# EAGLE design SensorController_revB (EAGLE 6.1)
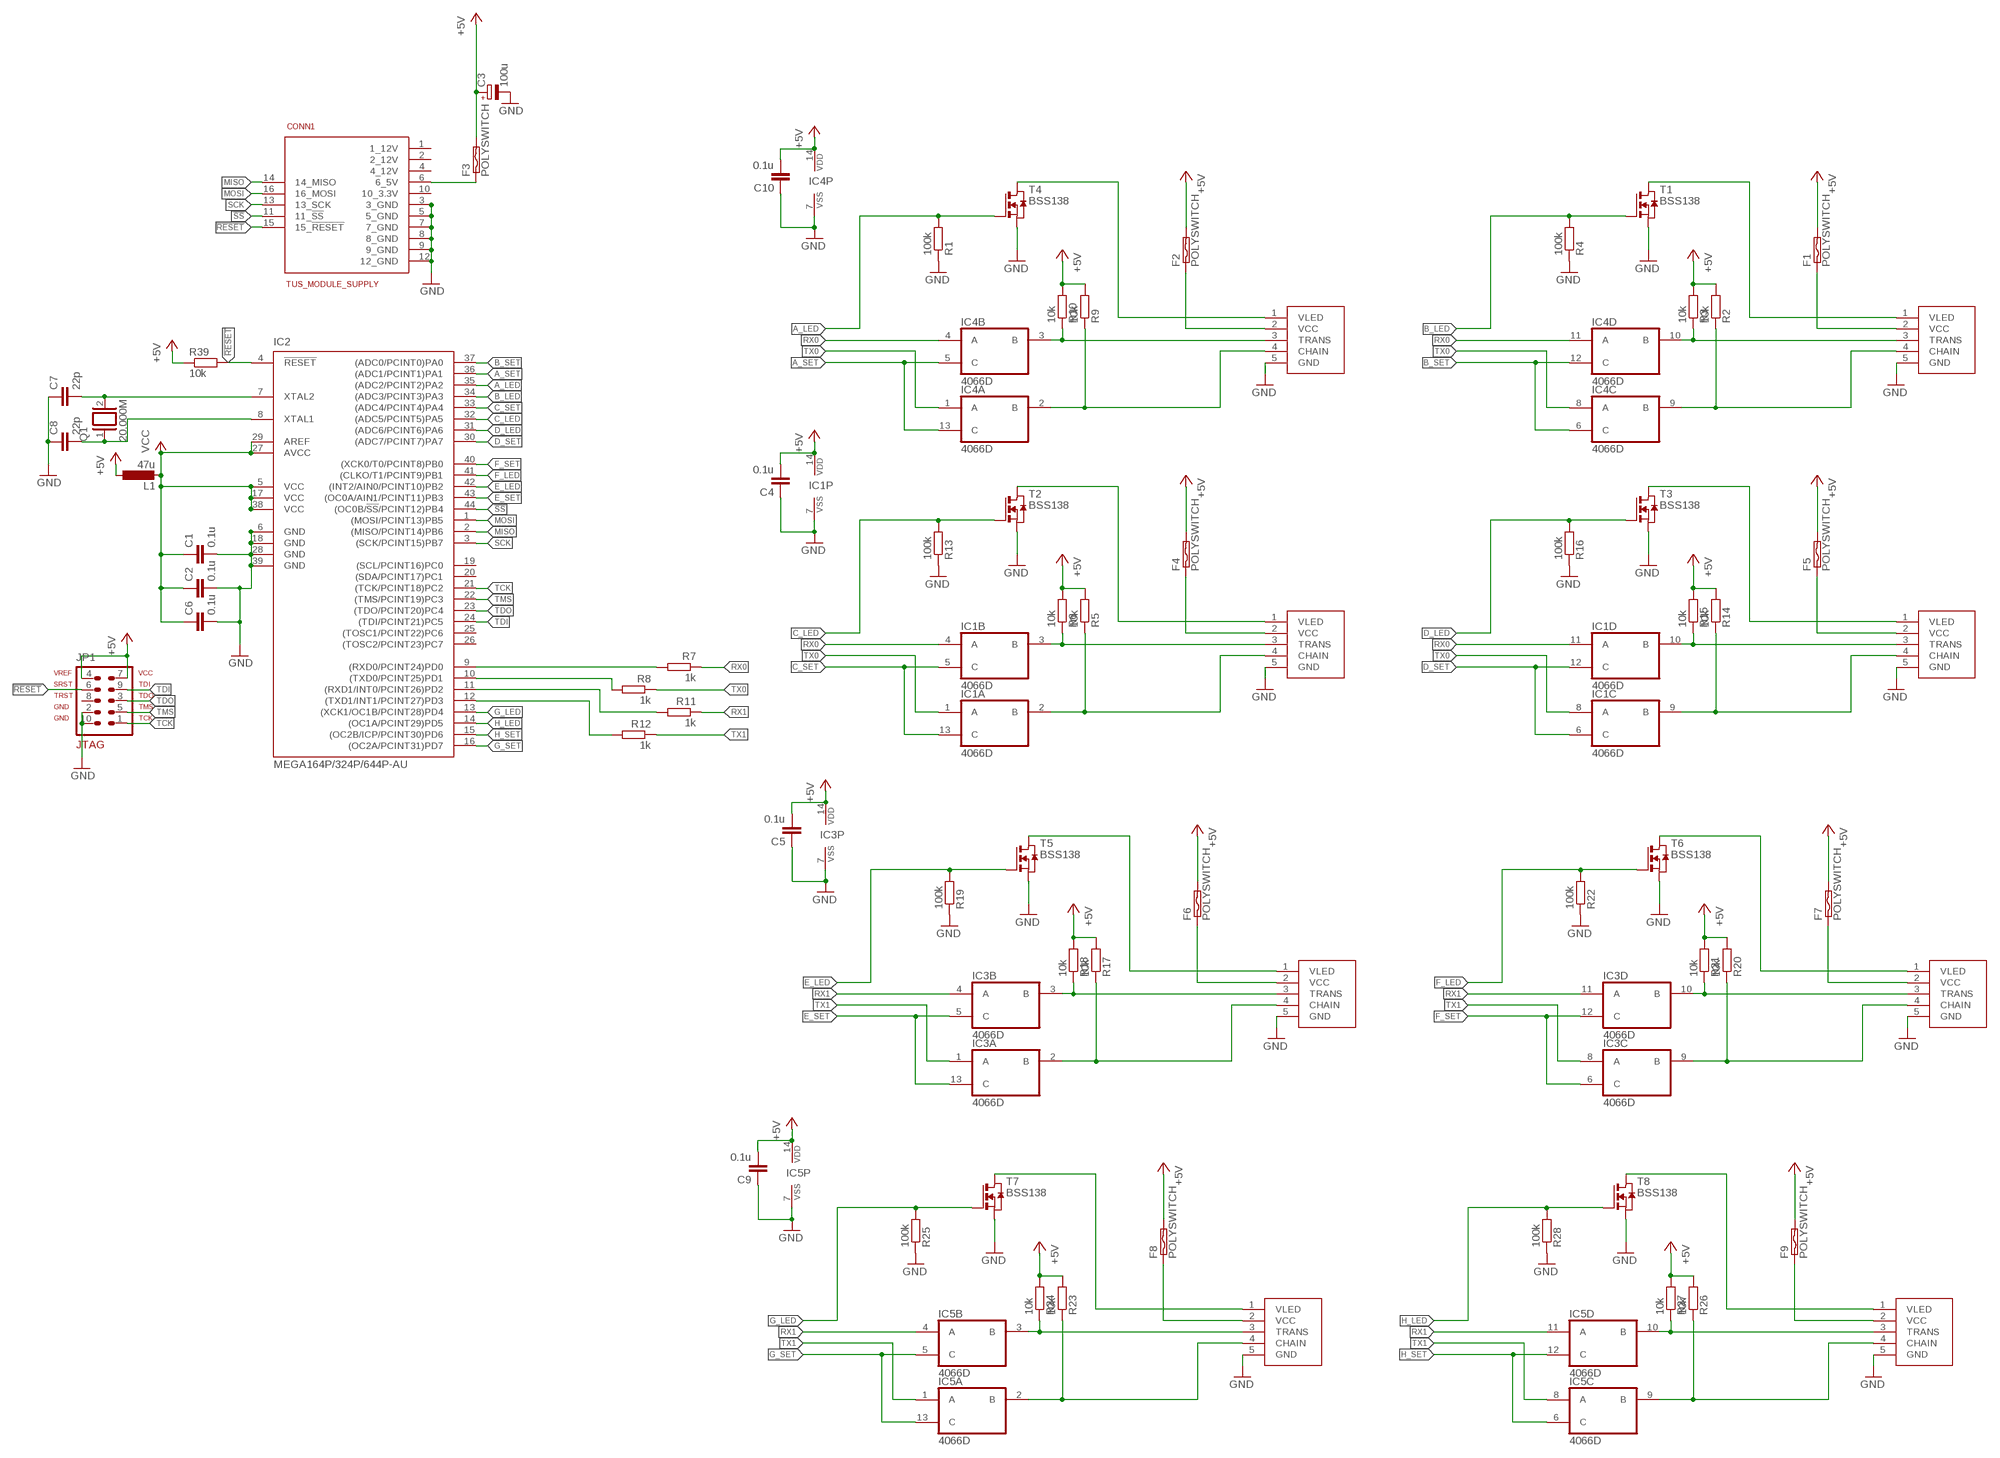
[diagram p0: schematic, sheet 1]

## Parts
A_OUT  SERIAL_SENSORXH  [XH-5]
B_OUT  SERIAL_SENSORXH  [XH-5]
C1  0.1u  C-EUC1608  [C1608]
C2  0.1u  C-EUC1608  [C1608]
C3  100u  CPOL-EUE2.5-5  [E2,5-5]
C4  0.1u  C-EUC1608  [C1608]
C5  0.1u  C-EUC1608  [C1608]
C6  0.1u  C-EUC1608  [C1608]
C7  22p  C-EUC1608  [C1608]
C8  22p  C-EUC1608  [C1608]
C9  0.1u  C-EUC1608  [C1608]
C10  0.1u  C-EUC1608  [C1608]
C_OUT  SERIAL_SENSORXH  [XH-5]
CONN1  TUS_MODULE_SUPPLY  [2X08]
D_OUT  SERIAL_SENSORXH  [XH-5]
E_OUT  SERIAL_SENSORXH  [XH-5]
F1  POLYSWITCH  [0207/2V]
F2  POLYSWITCH  [0207/2V]
F3  POLYSWITCH  [0207/2V]
F4  POLYSWITCH  [0207/2V]
F5  POLYSWITCH  [0207/2V]
F6  POLYSWITCH  [0207/2V]
F7  POLYSWITCH  [0207/2V]
F8  POLYSWITCH  [0207/2V]
F9  POLYSWITCH  [0207/2V]
F_OUT  SERIAL_SENSORXH  [XH-5]
G_OUT  SERIAL_SENSORXH  [XH-5]
H_OUT  SERIAL_SENSORXH  [XH-5]
IC1  4066D  [SO14]
IC2  MEGA164P/324P/644P-AU  [TQFP44]
IC3  4066D  [SO14]
IC4  4066D  [SO14]
IC5  4066D  [SO14]
JP1  AVR-JTAG-10  [AVR-JTAG-10]
L1  47u  L-EUL1812  [L1812]
Q1  20.000M  XTAL/S  [QS]
R1  100k  R-EU_R0603  [R0603]
R2  10k  R-EU_R0603  [R0603]
R3  10k  R-EU_R0603  [R0603]
R4  100k  R-EU_R0603  [R0603]
R5  10k  R-EU_R0603  [R0603]
R6  10k  R-EU_R0603  [R0603]
R7  1k  R-EU_R0603  [R0603]
R8  1k  R-EU_R0603  [R0603]
R9  10k  R-EU_R0603  [R0603]
R10  10k  R-EU_R0603  [R0603]
R11  1k  R-EU_R0603  [R0603]
R12  1k  R-EU_R0603  [R0603]
R13  100k  R-EU_R0603  [R0603]
R14  10k  R-EU_R0603  [R0603]
R15  10k  R-EU_R0603  [R0603]
R16  100k  R-EU_R0603  [R0603]
R17  10k  R-EU_R0603  [R0603]
R18  10k  R-EU_R0603  [R0603]
R19  100k  R-EU_R0603  [R0603]
R20  10k  R-EU_R0603  [R0603]
R21  10k  R-EU_R0603  [R0603]
R22  100k  R-EU_R0603  [R0603]
R23  10k  R-EU_R0603  [R0603]
R24  10k  R-EU_R0603  [R0603]
R25  100k  R-EU_R0603  [R0603]
R26  10k  R-EU_R0603  [R0603]
R27  10k  R-EU_R0603  [R0603]
R28  100k  R-EU_R0603  [R0603]
R39  10k  R-EU_R0603  [R0603]
T1  BSS138  NMOSSOT23  [SOT-23]
T2  BSS138  NMOSSOT23  [SOT-23]
T3  BSS138  NMOSSOT23  [SOT-23]
T4  BSS138  NMOSSOT23  [SOT-23]
T5  BSS138  NMOSSOT23  [SOT-23]
T6  BSS138  NMOSSOT23  [SOT-23]
T7  BSS138  NMOSSOT23  [SOT-23]
T8  BSS138  NMOSSOT23  [SOT-23]

## Nets
!RESET: CONN1.15(15_!RESET) IC2.4(!RESET) JP1.6 R39.2
!SS: CONN1.11(11_!SS) IC2.44((OC0B/!SS!/PCINT12)PB4)
+5V [+5v]: C3.+ C4.2 C5.2 C9.2 C10.2 F1.2 F2.2 F3.2 F4.2 F5.2 F6.2 F7.2 F8.2 F9.2 IC1.14(P:VDD) IC3.14(P:VDD) IC4.14(P:VDD) IC5.14(P:VDD) JP1.4 JP1.7 L1.1 R2.2 R3.2 R5.2 R6.2 R9.2 R10.2 R14.2 R15.2 R17.2 R18.2 R20.2 R21.2 R23.2 R24.2 R26.2 R27.2 R39.1
A_LED: IC2.35((ADC2/PCINT2)PA2) R1.2 T4.3(G)
A_SET: IC2.36((ADC1/PCINT1)PA1) IC4.5(B:C) IC4.13(A:C)
B_LED: IC2.34((ADC3/PCINT3)PA3) R4.2 T1.3(G)
B_SET: IC2.37((ADC0/PCINT0)PA0) IC4.6(C:C) IC4.12(D:C)
C_LED: IC2.32((ADC5/PCINT5)PA5) R13.2 T2.3(G)
C_SET: IC1.5(B:C) IC1.13(A:C) IC2.33((ADC4/PCINT4)PA4)
D_LED: IC2.31((ADC6/PCINT6)PA6) R16.2 T3.3(G)
D_SET: IC1.6(C:C) IC1.12(D:C) IC2.30((ADC7/PCINT7)PA7)
E_LED: IC2.42((INT2/AIN0/PCINT10)PB2) R19.2 T5.3(G)
E_SET: IC2.43((OC0A/AIN1/PCINT11)PB3) IC3.5(B:C) IC3.13(A:C)
F_LED: IC2.41((CLKO/T1/PCINT9)PB1) R22.2 T6.3(G)
F_SET: IC2.40((XCK0/T0/PCINT8)PB0) IC3.6(C:C) IC3.12(D:C)
G_LED: IC2.13((XCK1/OC1B/PCINT28)PD4) R25.2 T7.3(G)
G_SET: IC2.16((OC2A/PCINT31)PD7) IC5.5(B:C) IC5.13(A:C)
GND: A_OUT.5(GND) B_OUT.5(GND) C1.2 C2.2 C3.- C4.1 C5.1 C6.2 C7.1 C8.1 C9.1 C10.1 C_OUT.5(GND) CONN1.3(3_GND) CONN1.5(5_GND) CONN1.7(7_GND) CONN1.8(8_GND) CONN1.9(9_GND) CONN1.12(12_GND) D_OUT.5(GND) E_OUT.5(GND) F_OUT.5(GND) G_OUT.5(GND) H_OUT.5(GND) IC1.7(P:VSS) IC2.6(GND) IC2.18(GND) IC2.28(GND) IC2.39(GND) IC3.7(P:VSS) IC4.7(P:VSS) IC5.7(P:VSS) JP1.2 JP1.10 R1.1 R4.1 R13.1 R16.1 R19.1 R22.1 R25.1 R28.1 T1.2(S) T2.2(S) T3.2(S) T4.2(S) T5.2(S) T6.2(S) T7.2(S) T8.2(S)
H_LED: IC2.14((OC1A/PCINT29)PD5) R28.2 T8.3(G)
H_SET: IC2.15((OC2B/ICP/PCINT30)PD6) IC5.6(C:C) IC5.12(D:C)
MISO: CONN1.14(14_MISO) IC2.2((MISO/PCINT14)PB6)
MOSI: CONN1.16(16_MOSI) IC2.1((MOSI/PCINT13)PB5)
N$1: A_OUT.1(VLED) T4.1(D)
N$2: C8.2 IC2.8(XTAL1) Q1.1
N$3: B_OUT.4(CHAIN) IC4.9(C:B) R2.1
N$4: C7.2 IC2.7(XTAL2) Q1.2
N$5: B_OUT.3(TRANS) IC4.10(D:B) R3.1
N$6 [+5v]: B_OUT.2(VCC) F1.1
N$7: B_OUT.1(VLED) T1.1(D)
N$8: C_OUT.4(CHAIN) IC1.2(A:B) R5.1
N$9: A_OUT.4(CHAIN) IC4.2(A:B) R9.1
N$10: A_OUT.3(TRANS) IC4.3(B:B) R10.1
N$11: C_OUT.3(TRANS) IC1.3(B:B) R6.1
N$12 [+5v]: C_OUT.2(VCC) F4.1
N$13: C_OUT.1(VLED) T2.1(D)
N$14: D_OUT.4(CHAIN) IC1.9(C:B) R14.1
N$15: D_OUT.3(TRANS) IC1.10(D:B) R15.1
N$16 [+5v]: D_OUT.2(VCC) F5.1
N$17: IC2.9((RXD0/PCINT24)PD0) R7.2
N$18 [+5v]: A_OUT.2(VCC) F2.1
N$19: D_OUT.1(VLED) T3.1(D)
N$20: IC2.10((TXD0/PCINT25)PD1) R8.2
N$21 [+5v]: CONN1.6(6_5V) F3.1
N$22: IC2.11((RXD1/INT0/PCINT26)PD2) R11.2
N$23: IC2.12((TXD1/INT1/PCINT27)PD3) R12.2
N$24: E_OUT.4(CHAIN) IC3.2(A:B) R17.1
N$25: E_OUT.3(TRANS) IC3.3(B:B) R18.1
N$26 [+5v]: E_OUT.2(VCC) F6.1
N$27: E_OUT.1(VLED) T5.1(D)
N$28: F_OUT.4(CHAIN) IC3.9(C:B) R20.1
N$29: F_OUT.3(TRANS) IC3.10(D:B) R21.1
N$30 [+5v]: F7.1 F_OUT.2(VCC)
N$31: F_OUT.1(VLED) T6.1(D)
N$32: G_OUT.4(CHAIN) IC5.2(A:B) R23.1
N$33: G_OUT.3(TRANS) IC5.3(B:B) R24.1
N$34 [+5v]: F8.1 G_OUT.2(VCC)
N$35: G_OUT.1(VLED) T7.1(D)
N$36: H_OUT.4(CHAIN) IC5.9(C:B) R26.1
N$37: H_OUT.3(TRANS) IC5.10(D:B) R27.1
N$38 [+5v]: F9.1 H_OUT.2(VCC)
N$39: H_OUT.1(VLED) T8.1(D)
RX0: IC1.4(B:A) IC1.11(D:A) IC4.4(B:A) IC4.11(D:A) R7.1
RX1: IC3.4(B:A) IC3.11(D:A) IC5.4(B:A) IC5.11(D:A) R11.1
SCK: CONN1.13(13_SCK) IC2.3((SCK/PCINT15)PB7)
TCK: IC2.21((TCK/PCINT18)PC2) JP1.1
TDI: IC2.24((TDI/PCINT21)PC5) JP1.9
TDO: IC2.23((TDO/PCINT20)PC4) JP1.3
TMS: IC2.22((TMS/PCINT19)PC3) JP1.5
TX0: IC1.1(A:A) IC1.8(C:A) IC4.1(A:A) IC4.8(C:A) R8.1
TX1: IC3.1(A:A) IC3.8(C:A) IC5.1(A:A) IC5.8(C:A) R12.1
VCC: C1.1 C2.1 C6.1 IC2.5(VCC) IC2.17(VCC) IC2.27(AVCC) IC2.29(AREF) IC2.38(VCC) L1.2
Unconnected: CONN1.1(1_12V) CONN1.2(2_12V) CONN1.4(4_12V) CONN1.10(10_3.3V) IC2.19((SCL/PCINT16)PC0) IC2.20((SDA/PCINT17)PC1) IC2.25((TOSC1/PCINT22)PC6) IC2.26((TOSC2/PCINT23)PC7) JP1.8

## Library data of the parts
A_OUT B_OUT C_OUT D_OUT E_OUT F_OUT G_OUT H_OUT = myparts:SERIAL_SENSOR
C1 C2 C4-C10 = rcl:C-EU: CAPACITOR, European symbol
C3 = rcl:CPOL-EU: POLARIZED CAPACITOR, European symbol
CONN1 = tus:TUS_MODULE_SUPPLY
F1-F9 = myparts:POLYSWITCH
IC1 IC3-IC5 = 40xx:4066: Quad bilateral ANALOG SWITCH
IC2 = avr-7:MEGA164P/324P/644P-AU
JP1 = avr-7:AVR-JTAG-10: AVR JTAG Debug/Programming Header
L1 = resistor:L-EU: INDUCTOR, European symbol
Q1 = special:XTAL/S: CRYSTAL
R1-R28 R39 = rcl:R-EU_: RESISTOR, European symbol
T1-T8 = zetex:NMOSSOT23: MOS FET; OC_FARNELL: unknown; OC_NEWARK: unknown

## Net classes
1 +5v: width 0.762 mm
2 led: width 0.508 mm

## Board
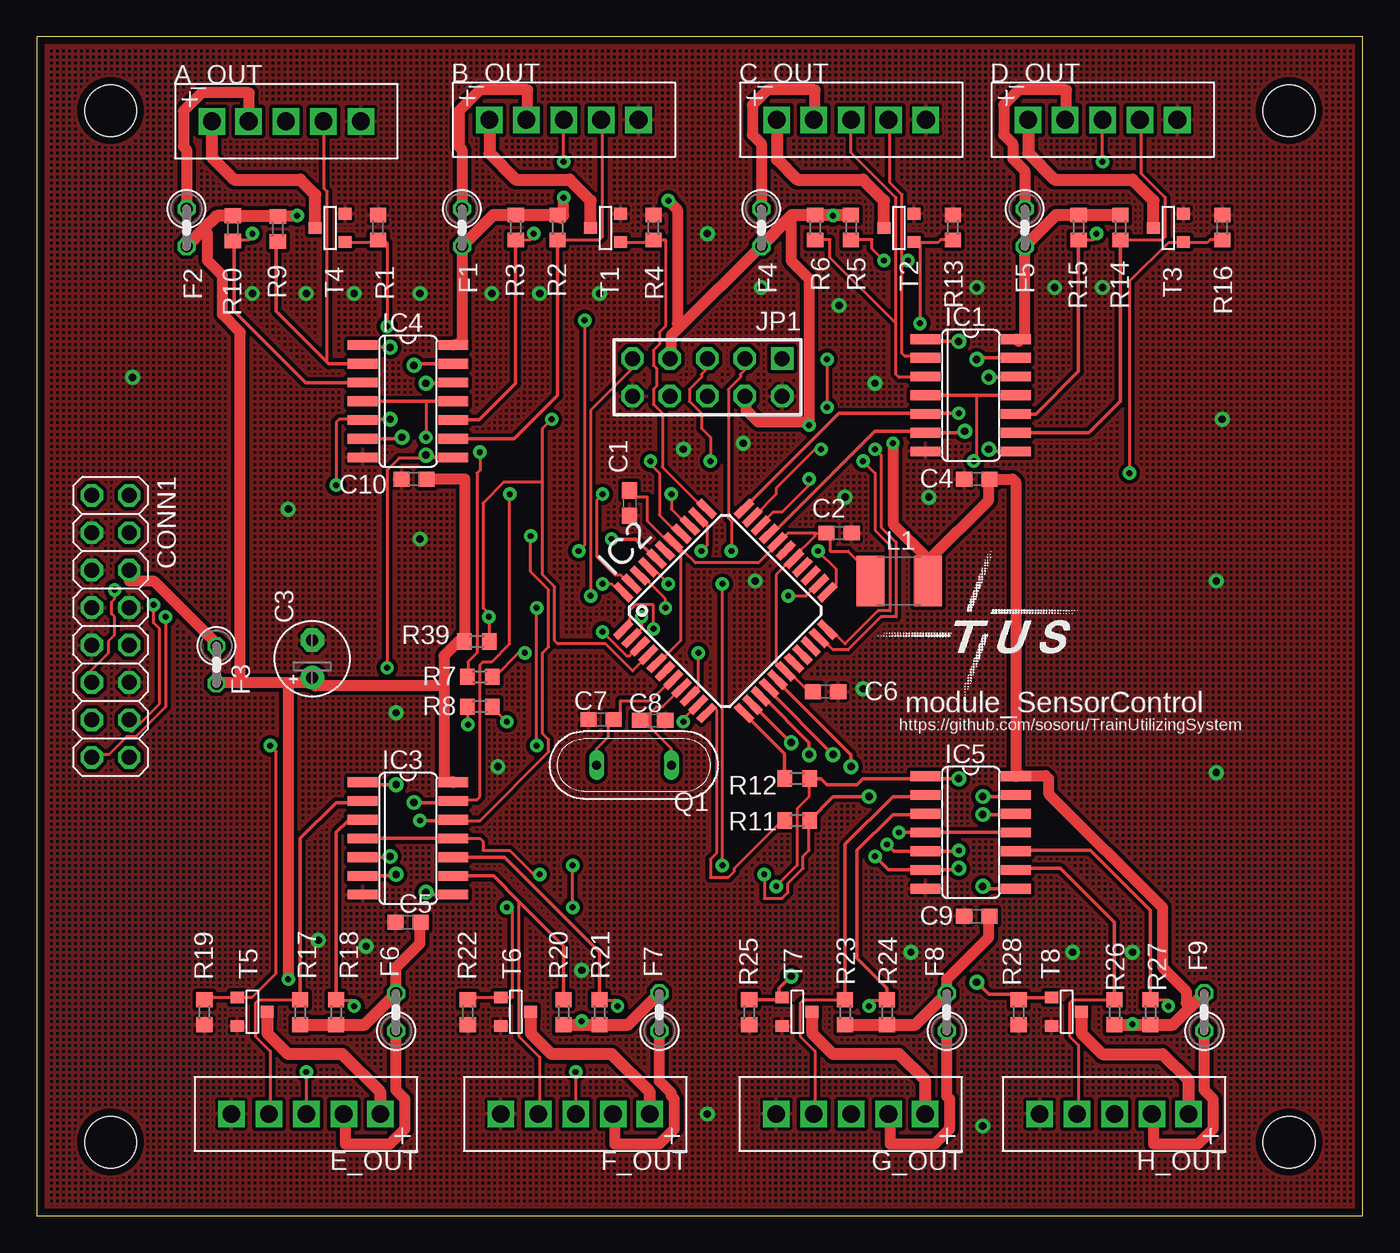
[diagram p1: board, top side]
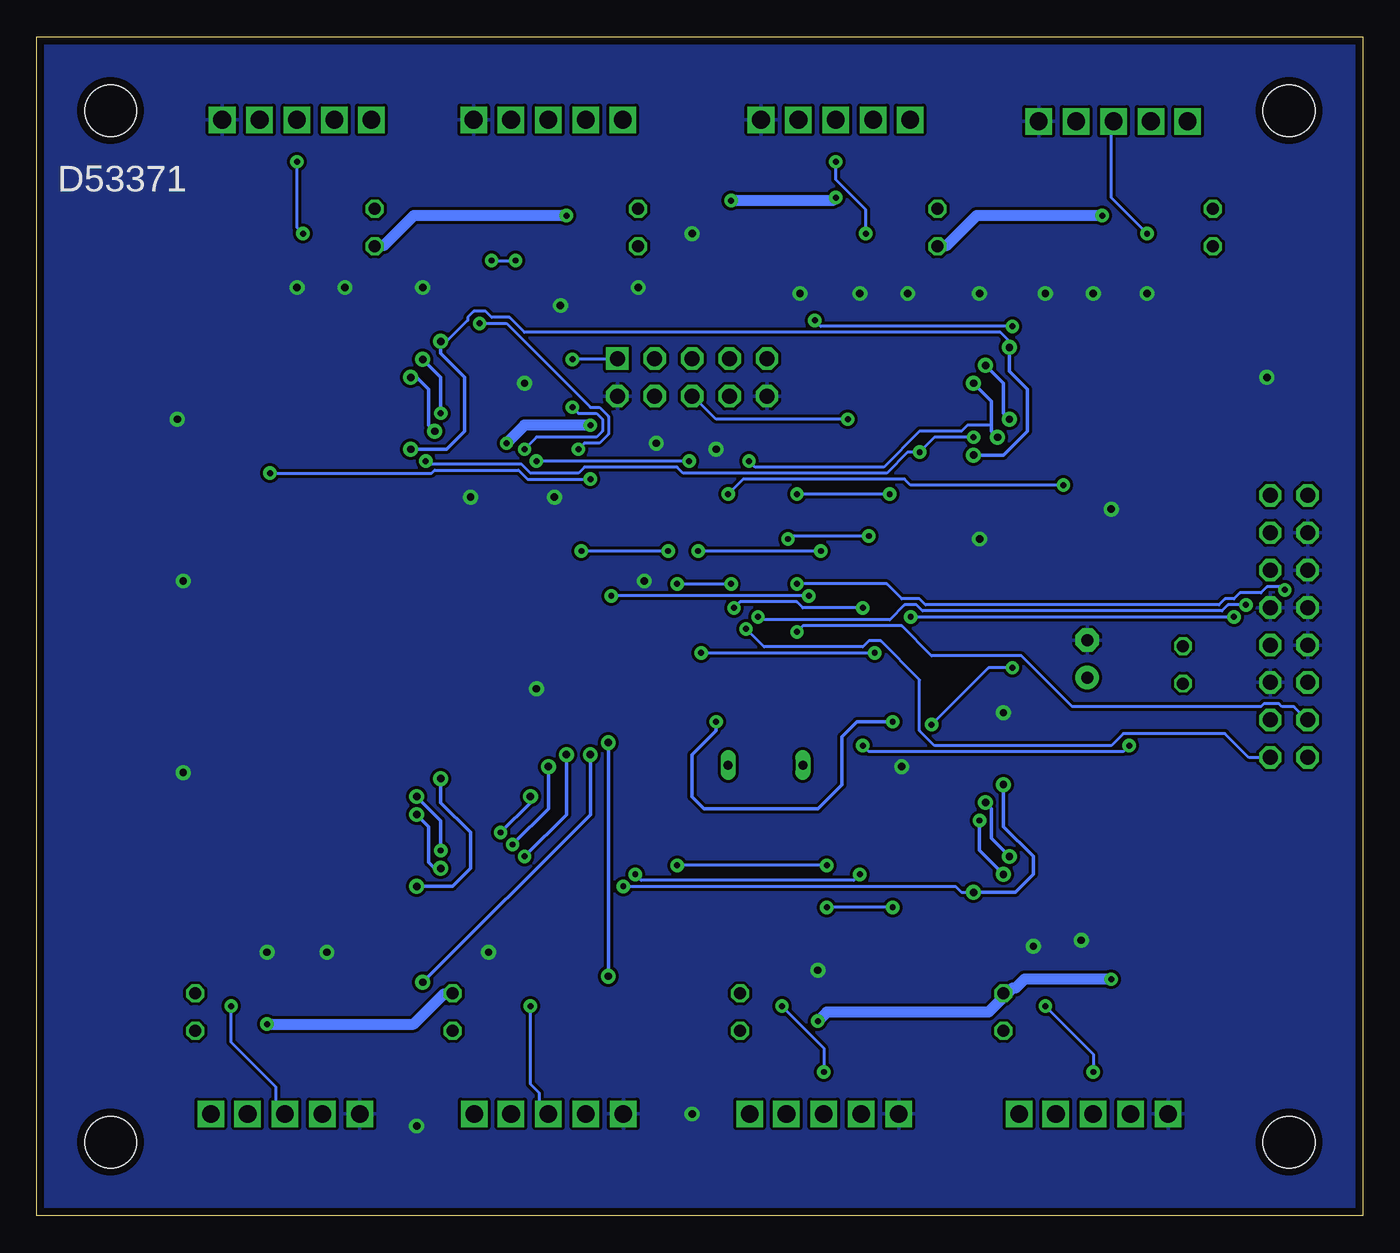
[diagram p2: board, bottom side, seen from below]

Size 90 x 80 mm. Coordinates in mm from the lower left corner, seen from the top.
Outline: 0,0 90,0 90,80 0,80 0,0
Copper layers (1*16): Top 0.035mm / dielectric 1.5mm / Bottom 0.035mm
Design rules: minimum track width 8mil, minimum drill 0.4mm, track to track 8mil, track to pad 8mil, pad to pad 8mil, via to via 8mil, smd to smd 8mil, copper to edge 20mil, drill to drill 8mil, minimum pad ring 8mil, minimum via ring 10mil, stop-mask expansion 3mil, vias tented up to drill 0mil, thermal gap 8mil
Holes 3.5 mm at 5,5 5,75 85,75 85,5

### Footprints (pad centres in the part's own frame; a part is rotated, then mirrored left to right if it is on the bottom)
XH-5 = drill 1.2 square: 1 -5.04,0; 2 -2.54,0; 3 0,0; 4 2.54,0; 5 5.08,0
C1608 = smd 1.1 x 1: 1 -0.85,0; 2 0.85,0
E2,5-5 = drill 0.813 pad 1.6: + -1.27,0 | drill 0.813 pad 1.6 octagon: - 1.27,0
2X08 = drill 1.016 octagon: 1 -8.89,-1.27; 2 -8.89,1.27; 3 -6.35,-1.27; 4 -6.35,1.27; 5 -3.81,-1.27; 6 -3.81,1.27; 7 -1.27,-1.27; 8 -1.27,1.27; 9 1.27,-1.27; 10 1.27,1.27; 11 3.81,-1.27; 12 3.81,1.27; 13 6.35,-1.27; 14 6.35,1.27; 15 8.89,-1.27; 16 8.89,1.27
0207/2V = drill 0.813 octagon: 1 -1.27,0; 2 1.27,0
SO14 = smd 0.66 x 2.032: 1 -3.81,-3.073; 2 -2.54,-3.073; 3 -1.27,-3.073; 4 0,-3.073; 5 1.27,-3.073; 6 2.54,-3.073; 7 3.81,-3.073; 8 3.81,3.073; 9 2.54,3.073; 10 1.27,3.073; 11 0,3.073; 12 -1.27,3.073; 13 -2.54,3.073; 14 -3.81,3.073
TQFP44 = smd 1.5 x 0.5: 1 -5.8,4; 2 -5.8,3.2; 3 -5.8,2.4; 4 -5.8,1.6; 5 -5.8,0.8; 6 -5.8,0; 7 -5.8,-0.8; 8 -5.8,-1.6; 9 -5.8,-2.4; 10 -5.8,-3.2; 11 -5.8,-4; 23 5.8,-4; 24 5.8,-3.2; 25 5.8,-2.4; 26 5.8,-1.6; 27 5.8,-0.8; 28 5.8,0; 29 5.8,0.8; 30 5.8,1.6; 31 5.8,2.4; 32 5.8,3.2; 33 5.8,4 | smd 0.5 x 1.5: 12 -4,-5.8; 13 -3.2,-5.8; 14 -2.4,-5.8; 15 -1.6,-5.8; 16 -0.8,-5.8; 17 0,-5.8; 18 0.8,-5.8; 19 1.6,-5.8; 20 2.4,-5.8; 21 3.2,-5.8; 22 4,-5.8; 34 4,5.8; 35 3.2,5.8; 36 2.4,5.8; 37 1.6,5.8; 38 0.8,5.8; 39 0,5.8; 40 -0.8,5.8; 41 -1.6,5.8; 42 -2.4,5.8; 43 -3.2,5.8; 44 -4,5.8
AVR-JTAG-10 = drill 1.016 square: 1 -5.08,-1.27 | drill 1.016 octagon: 2 -5.08,1.27; 3 -2.54,-1.27; 4 -2.54,1.27; 5 0,-1.27; 6 0,1.27; 7 2.54,-1.27; 8 2.54,1.27; 9 5.08,-1.27; 10 5.08,1.27
L1812 = smd 1.9 x 3.4: 1 -1.95,0; 2 1.95,0
QS = drill 0.61 long: 1 -2.54,0; 2 2.54,0
R0603 = smd 1 x 1.1: 1 -0.85,0; 2 0.85,0
SOT-23 = smd 0.787 x 0.889: 1 0.025,-1.016; 2 -0.94,1.016; 3 0.991,1.016

### Placement (x,y rotation side)
A_OUT  16.92,74.27 0 top
B_OUT  35.76,74.37 0 top
C1  40.23,48.36 270 top
C2  54.46,46.33 0 top
C3  18.69,37.8 90 top
C4  63.8,49.99 0 top
C5  25.2,19.91 0 top
C6  53.54,35.56 0 top
C7  38.3,33.68 0 top
C8  41.81,33.63 180 top
C9  63.8,20.32 0 top
C10  25.6,49.99 0 top
C_OUT  55.27,74.37 0 top
CONN1  5,40 270 top
D_OUT  72.34,74.37 0 top
E_OUT  18.29,6.91 180 top
F1  28.85,67.06 270 top
F2  10.16,67.06 270 top
F3  12.19,37.39 270 top
F4  49.17,67.06 270 top
F5  67.06,67.06 270 top
F6  24.38,13.82 90 top
F7  42.27,13.82 90 top
F8  61.77,13.82 90 top
F9  79.25,13.82 90 top
F_OUT  36.58,6.91 180 top
G_OUT  55.27,6.91 180 top
H_OUT  73.15,6.91 180 top
IC1  63.4,55.68 270 top
IC2  46.74,41.05 45 top
IC3  25.2,25.6 270 top
IC4  25.2,55.27 270 top
IC5  63.4,26.01 270 top
JP1  45.52,56.9 180 top
L1  58.52,43.08 180 top
Q1  40.54,30.58 180 top
R1  23.16,67.06 270 top
R2  35.36,67.06 90 top
R3  32.51,67.06 90 top
R4  41.86,67.06 270 top
R5  55.27,67.06 90 top
R6  52.83,67.06 90 top
R7  30.07,36.58 0 top
R8  30.07,34.54 0 top
R9  16.36,66.95 90 top
R10  13.31,67.01 90 top
R11  51.61,26.82 180 top
R12  51.61,29.67 180 top
R13  62.18,67.06 270 top
R14  73.56,67.06 90 top
R15  70.71,67.06 90 top
R16  80.47,67.06 270 top
R17  17.88,13.82 270 top
R18  20.32,13.82 270 top
R19  11.38,13.82 90 top
R20  35.76,13.82 270 top
R21  38.2,13.82 270 top
R22  29.26,13.82 90 top
R23  54.86,13.82 270 top
R24  57.71,13.82 270 top
R25  48.36,13.82 90 top
R26  73.15,13.82 270 top
R27  75.59,13.82 270 top
R28  66.65,13.82 90 top
R39  29.87,38.96 0 top
T1  38.61,67.06 270 top
T2  58.52,67.06 270 top
T3  76.81,67.06 270 top
T4  19.91,67.06 270 top
T5  14.63,13.82 90 top
T6  32.51,13.82 90 top
T7  51.61,13.82 90 top
T8  69.9,13.82 90 top

### Tracks (layer width: path | path; a pad name or v marks a point on that pad's centre or on a via)
!RESET  (via drill 0.4)
  Top 0.203: 34.34,49.78 31.7,49.78 30.28,48.36 30.28,41.25 30.68,40.84 v30.68,40.64 30.68,39.01 R39.2 | 34.34,49.78 34.34,43.48 35.15,42.67 35.15,39.01 35.36,38.81 38.61,38.81 40.44,36.98 41.45,38 IC2.4 | v8.74,40.64 8.74,34.54 6.71,32.51 6.1,32.51 4.88,31.29 3.86,31.29 CONN1.15 | v34.95,54.05 34.34,53.44 34.34,49.78
  Bottom 0.203: v30.68,40.64 v8.74,40.64 | v34.95,54.05 43.89,54.05 45.11,55.27 45.31,55.27 45.52,55.47 JP1.6
!SS  (via drill 0.4)
  Top 0.203: v38.41,42.88 39.01,42.88 39.42,42.47 39.62,42.47 IC2.44 | v5.28,42.47 5.28,41.86 5.08,41.66 5.08,40.84 5.28,40.64 5.28,39.42 4.88,39.01 4.88,38.2 3.66,36.98 3.66,36.37 CONN1.11
  Bottom 0.203: v38.41,42.88 32.31,42.88 31.29,41.86 30.07,41.86 29.67,41.45 9.75,41.45 9.35,41.86 8.74,41.86 8.33,42.27 6.91,42.27 6.5,42.67 5.49,42.67 v5.28,42.47
+5V  (via drill 0.4)
  Top 0.762: F8.2 61.77,16.05 64.62,18.9 64.62,20.32 C9.2 | v74.37,13.01 74.37,12.97 | 78.31,14.15 78.03,14.43 78.03,15.24 76.4,16.87 76.4,20.93 68.68,28.65 68.68,29.67 68.48,29.87 66.85,29.87 IC5.14 66.45,29.87 66.45,49.78 66.24,49.99 C4.2 64.62,49.99 64.62,48.56 60.55,44.5 60.55,43.08 L1.1 60.35,44.7 58.12,46.94 v58.12,52.43 | 70.75,67.91 70.92,67.87 R15.2 | F5.2 67.06,59.74 66.65,59.33 IC1.14 | 49.17,65.84 F4.2 48.97,65.63 43.69,60.35 | 43.69,60.35 43.08,59.74 43.08,58.32 JP1.7 | 52.43,53.85 48.97,53.85 48.16,54.66 48.16,55.47 JP1.4 | 52.43,53.85 52.43,63.6 51.21,64.82 51.21,67.46 51,67.67 | v54.05,67.87 54.05,67.91 | F6.2 24.38,16.87 26.01,18.49 26.01,19.91 C5.2 | 20.32,13.01 R18.2 | v36.98,13.21 36.98,12.97 | F1.2 28.85,59.13 28.45,59.13 IC4.14 | v17.68,67.87 16.66,67.87 R9.2 | 17.07,36.17 18.69,36.17 C3.+ 18.9,35.97 27.64,35.97 | 17.07,36.17 13.82,36.17 | 13.82,36.17 12.19,36.17 F3.2 | C10.2 29.06,49.99 29.06,39.01 R39.1 28.65,39.01 27.64,38 27.64,35.97 | 27.64,35.97 27.64,29.46 28.25,29.46 IC3.14 | 13.82,36.17 13.82,59.94 12.6,61.16 12.6,63.8 11.58,64.82 11.58,66.65 11.3,66.93 | 17.07,36.17 v17.07,16.05 | v42.88,68.89 43.48,68.28 43.48,60.55 43.69,60.35 | v35.76,69.09 35.76,67.87 35.56,67.67 R2.2 | v52.43,53.65 52.43,53.85
  Top 0.813: R9.2 16.36,67.86 R10.2 12.23,67.86 11.3,66.93 F2.2 | R2.2 R3.2 30.97,67.91 F1.2 | 49.17,65.84 51,67.67 51.24,67.91 R6.2 54.05,67.91 R5.2 | R14.2 70.75,67.91 70.71,67.87 | R15.2 69.18,67.91 F5.2 | R17.2 20.28,12.97 20.32,13.01 | R18.2 22.26,12.97 F6.2 | R20.2 36.98,12.97 R21.2 40.15,12.97 F7.2 | R23.2 R24.2 59.65,12.97 F8.2 | R26.2 74.37,12.97 R27.2 77.13,12.97 78.31,14.15 F9.2
  Bottom 0.762: v74.37,13.01 64.41,13.01 62.38,15.04 61.77,15.04 F8.2 | v54.05,67.87 64.41,67.87 66.45,65.84 67.06,65.84 F5.2 | v36.98,13.21 36.37,13.82 25.4,13.82 24.18,15.04 24.38,15.24 F6.2 23.98,15.24 23.77,15.44 23.57,15.44 22.96,16.05 v17.07,16.05 | v17.68,67.87 26.21,67.87 28.25,65.84 28.85,65.84 F1.2 | v42.88,68.89 35.97,68.89 v35.76,69.09 | v58.12,52.43 56.9,53.65 v52.43,53.65
A_LED  (via drill 0.4)
  Top 0.203: 23.16,66.24 22.76,66.24 22.55,66.04 20.93,66.04 T4.3 | v45.11,45.11 45.52,45.52 45.52,46.94 45.11,47.35 44.91,47.35 IC2.35 | v36.78,45.11 37.19,45.52 v37.19,60.76 | v23.77,60.35 23.77,66.04 23.57,66.24 23.16,66.24 | 23.16,66.24 R1.2
  Bottom 0.203: v36.78,45.11 v45.11,45.11 | v37.19,60.76 36.78,60.35 v23.77,60.35
A_SET  (via drill 0.4, 0.5)
  Top 0.203: v43.08,48.97 43.08,47.95 44.09,46.94 44.3,46.94 IC2.36 | v20.32,49.58 20.32,53.85 20.52,54.05 21.95,54.05 IC4.5
  Top 0.254: IC4.13 25.7,57.81 v25.6,57.71 | v23.98,54.05 22.17,54.05 IC4.5
  Bottom 0.203: v43.08,48.97 42.06,49.99 31.09,49.99 30.68,49.58 v20.32,49.58
  Bottom 0.254: v25.6,57.71 24.38,56.49 24.38,54.46 v23.98,54.05
B_LED
  Top 0.203: 41.86,66.24 41.45,66.24 41.25,66.04 39.62,66.04 T1.3 | 41.86,66.24 42.67,66.24 42.67,60.35 42.27,59.94 42.27,59.13 41.86,58.73 41.86,57.71 42.06,57.51 42.06,56.29 41.86,56.08 41.86,55.07 42.47,54.46 42.47,50.8 45.11,48.16 45.31,48.16 IC2.34 | 41.86,66.24 R4.2
B_SET  (via drill 0.4, 0.5)
  Top 0.203: v41.66,51.21 41.66,51 42.27,50.39 42.27,47.55 43.48,46.33 43.69,46.33 IC2.37
  Top 0.254: IC4.6 24.69,52.73 v24.79,52.83 | v26.42,56.49 28.22,56.49 IC4.12
  Bottom 0.203: v41.66,51.21 41.25,50.8 32.51,50.8 30.07,53.24 27.23,53.24 26.82,53.65 25.2,53.65
  Bottom 0.254: v24.79,52.83 25.2,53.24 25.2,53.65 25.2,55.27 v26.42,56.49
C_LED  (via drill 0.4)
  Top 0.203: 59.94,66.04 61.16,66.04 61.37,66.24 62.18,66.24 R13.2 | 59.94,66.04 59.54,66.04 T2.3 59.94,66.04 | v53.24,52.02 52.83,52.02 50.19,49.38 50.19,48.97 48.77,47.55 IC2.32 | 59.94,66.04 v59.94,60.55
  Bottom 0.203: v53.24,52.02 52.83,52.43 51.82,52.43 51.21,53.03 51.21,54.25 51.82,54.86 52.43,54.86 58.12,60.55 v59.94,60.55
C_SET  (via drill 0.4, 0.5)
  Top 0.254: IC1.13 63.91,58.22 v63.8,58.12 | v62.59,54.46 60.38,54.46 IC1.5 60.27,54.46 54.46,54.46 48.01,48.01 IC2.33
  Bottom 0.254: v63.8,58.12 62.59,56.9 v62.59,54.46
D_LED  (via drill 0.4)
  Top 0.203: 77.83,66.04 79.45,66.04 79.65,66.24 80.47,66.24 R16.2 | v52.43,49.99 52.43,49.58 50.6,47.75 49.99,47.75 49.17,46.94 IC2.31 | v74.17,50.39 74.17,63.4 76.81,66.04 77.83,66.04 | 77.83,66.04 T3.3
  Bottom 0.203: v52.43,49.99 56.69,49.99 57.3,50.6 62.99,50.6 63.2,50.39 v74.17,50.39
D_SET  (via drill 0.5)
  Top 0.254: v62.99,53.24 62.48,53.14 IC1.6 60.22,53.24 56.9,53.24 49.94,46.28 IC2.30 | v64.62,56.9 66.42,56.9 IC1.12
  Bottom 0.254: v62.99,53.24 63.4,53.65 63.4,56.08 64.21,56.9 v64.62,56.9
E_LED  (via drill 0.4)
  Top 0.203: 13.61,14.83 11.99,14.83 11.79,14.63 11.38,14.63 R19.2 | v42.67,41.25 42.67,41.86 41.25,43.28 41.05,43.28 IC2.42 | v33.93,31.9 v33.93,41.25 | v15.85,31.9 16.26,31.5 16.26,16.46 14.63,14.83 13.61,14.83 | 13.61,14.83 T5.3
  Bottom 0.203: v42.67,41.25 42.27,41.66 38.41,41.66 38,41.25 v33.93,41.25 | v33.93,31.9 33.53,31.5 16.26,31.5 v15.85,31.9
E_SET  (via drill 0.4, 0.5)
  Top 0.203: v38.41,48.97 38,48.56 38,44.7 39.22,43.48 39.62,43.48 40.03,43.08 40.23,43.08 IC2.43 | v32.11,48.97 32.11,38.81 30.89,37.59 30.28,37.59 30.07,37.39 30.07,28.45 29.87,28.25 28.45,28.25 IC3.13
  Top 0.254: IC3.5 23.93,24.33 v23.98,24.38 | v25.6,28.04 28.17,28.04 IC3.13
  Bottom 0.203: v32.11,48.97 v38.41,48.97
  Bottom 0.254: v23.98,24.38 25.2,25.6 25.2,27.64 v25.6,28.04
F_LED  (via drill 0.4)
  Top 0.203: 31.5,14.83 29.87,14.83 29.67,14.63 29.26,14.63 R22.2 | v42.88,42.88 41.86,43.89 41.66,43.89 IC2.41 | v46.53,23.77 v46.53,42.88 | v36.37,20.93 v36.37,23.77 | v31.9,20.93 32.31,20.93 32.31,14.83 31.5,14.83 | 31.5,14.83 T6.3
  Bottom 0.203: v46.53,42.88 v42.88,42.88 | v36.37,23.77 v46.53,23.77 | v31.9,20.93 v36.37,20.93
F_SET  (via drill 0.4, 0.5)
  Top 0.203: 41.86,44.7 42.06,44.7 IC2.40 | v33.53,46.13 33.53,43.69 34.75,42.47 34.75,38.61 34.34,38.2 34.34,32.72 34.75,32.31 34.75,31.5 30.07,26.82 28.45,26.82 IC3.12
  Top 0.254: IC3.6 24.28,23.06 v24.38,23.16 | v26.01,26.82 28.22,26.82 IC3.12 | v39.01,45.92 40.64,45.92 41.86,44.7
  Bottom 0.203: v39.01,45.92 39.22,46.13 v33.53,46.13
  Bottom 0.254: v24.38,23.16 26.01,24.79 v26.01,26.82
G_LED  (via drill 0.5)
  Top 0.254: IC2.13 48.63,34.68 v51.21,32.11 | v51.21,16.26 50.39,15.44 50.39,15.01 T7.3 50.46,14.67 R25.2
  Bottom 0.254: v51.21,32.11 v51.21,16.26
G_SET  (via drill 0.4, 0.5)
  Top 0.203: 50.39,36.17 50.39,36.37 IC2.16
  Top 0.254: v62.59,24.79 62.13,24.74 IC5.5 58.17,24.74 v57.71,25.2 | v64.21,28.45 66.37,28.45 IC5.13 | v55.27,30.48 55.27,31.29 50.39,36.17
  Bottom 0.254: v62.59,24.79 62.59,26.82 v64.21,28.45 | v57.71,25.2 55.27,27.64 v55.27,30.48
GND  (via drill 0.5)
  other vias: 80.47,54.05 80.06,43.08 80.06,30.07 59.33,17.88 70.31,17.88 64.21,6.1 45.52,6.91 22.35,18.29 26.01,62.59 26.01,45.92 17.07,47.96 6.5,56.9 45.52,66.65 49.17,62.99 63.8,62.99 54.46,61.77 38.2,62.59 34.14,62.59 30.89,62.59 18.29,62.59 21.54,62.59 14.63,62.59 69.09,62.99 72.34,62.99 60.55,48.77 54.86,48.77 56.08,35.76 48.77,43.08 24.38,34.14 31.29,30.48 19.1,18.69 36.98,16.66 74.37,17.88 47.96,52.43 43.89,52.02 56.9,56.49
  pour Bottom (hatched): -1.27,81.28 -1.27,-1.27 92.71,-1.27 92.71,81.28
  pour Top (isolate 0.254, hatched): -2.54,82.55 -2.54,-3.81 95.25,-3.81 95.25,82.55
H_LED  (via drill 0.5)
  Top 0.254: IC2.14 49.28,35.25 52.43,32.11 v52.43,31.29 | v63.8,15.85 64.62,15.04 66.28,15.04 R28.2 66.79,14.81 T8.3
  Bottom 0.254: v52.43,31.29 52.43,27.23 v63.8,15.85
H_SET  (via drill 0.4, 0.5)
  Top 0.203: 49.58,35.76 IC2.15
  Top 0.254: v62.59,23.57 62.08,23.47 IC5.6 57.81,23.47 v56.9,24.38 | v64.21,27.23 66.42,27.23 IC5.12 | v54.05,31.29 49.58,35.76
  Bottom 0.254: v62.59,23.57 62.99,23.57 63.4,23.98 63.4,26.42 v64.21,27.23 | v56.9,24.38 54.05,27.23 v54.05,31.29
MISO  (via drill 0.4)
  Top 0.203: v41.05,40.64 41.05,39.83 40.44,39.22 IC2.2 | v7.92,41.45 7.92,40.23 8.33,39.83 8.33,34.75 6.5,32.92 6.3,32.92 6.3,33.53 CONN1.14
  Bottom 0.203: v41.05,40.64 40.84,40.44 32.11,40.44 31.09,41.45 30.28,41.45 29.87,41.05 9.55,41.05 9.14,41.45 v7.92,41.45
MOSI  (via drill 0.4)
  Top 0.203: v41.86,39.83 41.86,41.45 40.64,41.45 40.23,41.05 40.23,40.23 39.83,39.83 IC2.1
  Bottom 0.203: v41.86,39.83 40.64,38.61 33.93,38.61 33.53,39.01 32.72,39.01 30.07,36.37 30.07,32.92 29.06,31.9 17.07,31.9 16.26,32.72 9.35,32.72 7.72,31.09 6.3,31.09 CONN1.16
N$1
  Top 0.813: A_OUT.1 11.88,71.84 13.41,70.31 17.88,70.31 18.9,69.29 T4.1
N$2
  Top 0.203: 41.66,33.73 41.05,33.73 C8.2 | 41.66,33.73 41.66,33.12 43.08,31.7 Q1.1 | 41.66,33.73 41.66,34.14 42.06,34.54 42.47,34.54 43.69,35.76 IC2.8
N$3
  Top 0.203: B_OUT.4 38.41,74.37 38.41,66.45 38.2,66.24 35.36,66.24 R2.1
  Top 0.254: IC4.9 32.41,52.73 35.36,55.68 R2.1
N$4
  Top 0.203: Q1.2 38,31.7 38.81,32.51 38.81,33.73 39.01,33.73 C7.2 39.22,33.73 39.62,33.73 39.62,34.95 41.66,34.95 43.08,36.37 IC2.7
N$5  (via drill 0.4)
  Top 0.203: v35.76,71.53 B_OUT.3 | v33.73,66.65 33.73,66.45 33.53,66.24 32.51,66.24 R3.1
  Top 0.254: IC4.10 30.02,54 32.51,56.49 R3.1
  Bottom 0.203: v35.76,71.53 35.76,70.31 33.73,68.28 v33.73,66.65
N$6
  Top 0.762: F1.1 28.85,72.34 28.65,72.54 28.65,74.98 30.07,76.4 33.33,76.4 33.33,74.37 B_OUT.2
N$7
  Top 0.813: B_OUT.1 30.72,72.1 32.51,70.31 36.17,70.31 37.59,68.89 T1.1
N$8  (via drill 0.4)
  Top 0.203: v57.51,64.82 56.69,65.63 56.69,66.24 55.27,66.24 R5.1 | 58.73,64.41 v59.13,64.82 | 58.73,64.41 58.73,58.52 58.93,58.32 60.15,58.32 IC1.2 | 58.73,64.41 58.73,69.29 57.91,70.1 57.91,74.37 C_OUT.4
  Bottom 0.203: v59.13,64.82 v57.51,64.82
N$9
  Top 0.203: 19.71,57.91 19.71,69.49 19.51,69.7 19.51,74.17 A_OUT.4
  Top 0.254: IC4.2 19.81,57.81 19.71,57.91 16.26,61.37 16.26,66 R9.1
N$10  (via drill 0.4)
  Top 0.203: v14.63,66.65 14.63,66.45 14.43,66.24 13.41,66.24 R10.1
  Top 0.254: IC4.3 18.24,56.54 13.41,61.37 13.41,66.05 R10.1
  Bottom 0.203: v14.63,66.65 17.07,69.09 17.07,74.17 A_OUT.3
N$11
  Top 0.203: 58.32,60.55 53.85,65.02 53.85,66.24 52.83,66.24 R6.1 | 58.32,60.55 58.32,57.1 58.52,56.9 60.15,56.9 IC1.3 | C_OUT.3 55.27,72.14 58.32,69.09 58.32,60.55
N$12
  Top 0.762: F4.1 49.17,72.75 48.56,73.36 48.56,75.39 49.58,76.4 52.83,76.4 52.83,74.37 C_OUT.2
N$13
  Top 0.813: C_OUT.1 50.23,71.69 51.61,70.31 56.08,70.31 57.51,68.89 T2.1
N$14
  Top 0.203: D_OUT.4 74.98,74.37 74.98,70.71 76.61,69.09 76.61,66.45 76.4,66.24 73.56,66.24 R14.1
  Top 0.254: IC1.9 71.42,53.14 73.56,55.27 R14.1
N$15  (via drill 0.4)
  Top 0.203: v72.34,71.53 D_OUT.3 | v71.93,66.65 71.93,66.45 71.73,66.24 70.71,66.24 R15.1
  Top 0.254: IC1.10 67.82,54.41 70.71,57.3 R15.1
  Bottom 0.203: v72.34,71.53 72.34,67.06 v71.93,66.65
N$16
  Top 0.762: F5.1 67.06,70.92 66.24,71.73 66.24,72.75 65.63,73.36 65.63,75.39 66.65,76.4 69.9,76.4 69.9,74.37 D_OUT.2
N$17  (via drill 0.4)
  Top 0.203: v33.12,38.2 32.72,38.2 31.09,36.58 R7.2 | v44.91,38.2 44.91,35.76 44.5,35.36 IC2.9
  Bottom 0.203: v44.91,38.2 v33.12,38.2
N$18
  Top 0.762: F2.1 10.16,72.34 9.96,72.54 9.96,74.98 11.18,76.2 14.43,76.2 14.43,74.37 A_OUT.2
N$19
  Top 0.813: D_OUT.1 67.3,72.1 69.09,70.31 74.37,70.31 75.79,68.89 T3.1
N$20  (via drill 0.4)
  Top 0.203: v31.9,33.53 31.29,34.14 31.29,34.34 31.09,34.54 R8.2 | v43.89,33.53 43.89,33.73 44.7,34.54 IC2.10
  Bottom 0.254: v31.9,33.53 34.34,33.53 35.36,32.51 35.36,29.26 36.98,27.64 44.7,27.64 45.52,28.45 45.52,31.29 43.89,32.92 v43.89,33.53
N$21
  Top 0.762: F3.1 12.19,38.81 7.92,43.08 6.3,43.08 6.3,43.69 CONN1.6
N$22
  Top 0.203: R11.2 50.6,26.82 47.35,23.57 47.35,23.37 46.94,22.96 45.72,22.96 45.72,24.18 46.13,24.59 46.13,34.34 45.92,34.54 45.52,34.14 IC2.11
N$23
  Top 0.254: R12.2 50.76,31.36 IC2.12
N$24
  Top 0.203: E_OUT.4 15.85,6.91 15.85,11.18 14.83,12.19 14.83,14.43 15.04,14.63 17.88,14.63 R17.1
  Top 0.254: R17.1 17.88,25.6 20.32,28.04 22.02,28.04 IC3.2
N$25  (via drill 0.4)
  Top 0.203: v18.29,9.75 E_OUT.3 | v21.54,14.22 21.54,14.43 21.34,14.63 20.32,14.63 R18.1
  Top 0.254: R18.1 20.32,26.01 21.13,26.82 22.07,26.82 IC3.3
  Bottom 0.203: v18.29,9.75 18.29,10.97 v21.54,14.22
N$26
  Top 0.762: F6.1 24.38,8.53 24.99,7.92 24.99,5.89 23.98,4.88 20.93,4.88 20.93,6.91 E_OUT.2
N$27
  Top 0.813: E_OUT.1 23.33,8.37 20.73,10.97 17.07,10.97 15.65,12.39 T5.1
N$28
  Top 0.203: 32.72,21.34 32.72,12.19 34.14,10.77 34.14,6.91 F_OUT.4
  Top 0.254: IC3.9 30.99,23.06 32.72,21.34 35.76,18.29 R20.1
N$29  (via drill 0.4)
  Top 0.203: v36.58,9.75 F_OUT.3 | v39.42,14.22 39.42,14.43 39.22,14.63 38.2,14.63 R21.1
  Top 0.254: IC3.10 31.75,24.33 38.2,17.88 R21.1
  Bottom 0.203: v36.58,9.75 36.58,11.38 v39.42,14.22
N$30
  Top 0.762: F7.1 42.27,9.14 43.08,8.33 43.08,8.13 43.28,7.92 43.28,5.89 42.27,4.88 39.22,4.88 39.22,6.91 F_OUT.2
N$31
  Top 0.813: F_OUT.1 41.62,8.37 39.01,10.97 34.95,10.97 33.53,12.39 T6.1
N$32
  Top 0.203: G_OUT.4 52.83,6.91 52.83,11.18 51.82,12.19 51.82,14.43 52.02,14.63 54.86,14.63 R23.1
  Top 0.254: R23.1 54.86,25.2 58.12,28.45 60.22,28.45 IC5.2
N$33  (via drill 0.4)
  Top 0.203: 60.35,27.23 IC5.3 | v56.49,14.22 56.49,14.63 57.71,14.63 R24.1
  Top 0.254: R24.1 57.71,15.44 55.68,17.48 55.68,24.79 58.12,27.23 60.35,27.23 60.55,27.23
  Bottom 0.203: v56.49,14.22 56.49,8.94 55.88,8.33 55.88,6.91 G_OUT.3
N$34
  Top 0.762: F8.1 61.77,8.13 61.98,7.92 61.98,5.89 60.96,4.88 57.91,4.88 57.91,6.91 G_OUT.2
N$35
  Top 0.813: G_OUT.1 60.31,9.18 58.52,10.97 54.05,10.97 52.63,12.39 T7.1
N$36
  Top 0.203: H_OUT.4 70.71,6.91 70.71,11.58 70.1,12.19 70.1,14.43 70.31,14.63 73.15,14.63 R26.1
  Top 0.254: R26.1 73.15,19.91 69.49,23.57 66.57,23.57 IC5.9
N$37  (via drill 0.4)
  Top 0.203: 66.65,24.79 IC5.10 | v76.81,14.22 76.81,14.63 75.59,14.63 R27.1
  Top 0.254: R27.1 75.59,20.73 71.53,24.79 66.65,24.79
  Bottom 0.203: v76.81,14.22 76.81,11.79 73.76,8.74 73.76,6.91 H_OUT.3
N$38
  Top 0.762: F9.1 79.25,8.53 79.86,7.92 79.86,5.89 78.84,4.88 75.79,4.88 75.79,6.91 H_OUT.2
N$39
  Top 0.813: H_OUT.1 78.19,9.18 76.4,10.97 72.34,10.97 70.92,12.39 T8.1
RX0  (via drill 0.4)
  Top 0.203: v30.07,51.82 30.07,50.6 29.87,50.39 29.87,38.2 29.26,37.59 29.26,36.58 R7.1 | 26.42,55.27 v26.42,52.83 | 63.8,55.68 63.8,51.41 v63.6,51.21
  Top 0.254: IC1.11 63.8,55.68 IC1.4 | IC4.4 26.42,55.27 IC4.11
  Bottom 0.203: v26.42,52.83 29.06,52.83 v30.07,51.82 30.89,51.82 32.31,50.39 46.13,50.39 46.53,50.8 52.83,50.8 53.24,50.39 56.49,50.39 57.1,51 63.4,51 v63.6,51.21
RX1  (via drill 0.4, 0.5)
  Top 0.203: v49.38,23.16 49.38,21.54 50.6,21.54 51,21.95 51,22.55 52.02,23.57 52.02,24.38 52.43,24.79 52.43,26.82 R11.1 | v34.14,23.16 33.73,23.16 32.11,24.79 30.28,24.79 30.28,25.4 30.07,25.6 IC3.11
  Top 0.254: 66.65,26.01 IC5.11 IC5.4 v58.52,26.01 | IC3.4 IC3.11 | v56.49,28.45 54.05,28.45 53.24,27.64 53.24,27.6 R11.1
  Bottom 0.203: v49.38,23.16 48.97,22.76 34.54,22.76 v34.14,23.16
  Bottom 0.254: v58.52,26.01 56.49,28.04 v56.49,28.45
SCK  (via drill 0.4)
  Top 0.203: v38.41,39.62 40.03,38 40.23,38 40.84,38.61 IC2.3
  Bottom 0.203: v38.41,39.62 38,40.03 31.29,40.03 29.26,38 23.16,38 19.71,34.54 6.91,34.54 6.71,34.75 5.69,34.75 5.49,34.54 4.67,34.54 4.06,33.93 4.06,33.73 3.86,33.73 CONN1.13
TCK  (via drill 0.4)
  Top 0.203: v56.9,52.02 57.3,51.61 57.3,46.74 58.32,45.72 58.32,40.64 57.3,40.64 55.07,38.41 54.05,38.41 53.44,39.01 53.24,39.01 IC2.21 | v53.65,58.12 v53.65,54.86
  Bottom 0.203: v56.9,52.02 56.08,52.83 52.02,52.83 51.61,53.24 51.61,54.05 52.02,54.46 53.24,54.46 v53.65,54.86 | v53.65,58.12 50.6,58.12 JP1.1
TDI  (via drill 0.4)
  Top 0.203: v51,42.06 52.22,42.06 53.03,42.88 IC2.24 | v37.59,42.06 37.59,54.66 40.44,57.51 JP1.9
  Bottom 0.203: v37.59,42.06 v51,42.06
TDO  (via drill 0.4)
  Top 0.203: v53.03,45.11 54.25,43.89 54.25,42.88 53.85,42.47 IC2.23 | v47.14,45.11 47.14,47.14 46.94,47.35 46.94,56.08 47.75,56.9 47.75,57.1 48.16,57.51 48.16,58.12 JP1.3
  Bottom 0.203: v47.14,45.11 v53.03,45.11
TMS  (via drill 0.4)
  Top 0.203: v56.08,51.21 56.9,50.39 56.9,46.53 57.91,45.52 57.91,41.05 57.1,41.05 54.86,38.81 54.05,39.62 53.85,39.62 IC2.22 | v45.72,51.21 45.72,52.83 45.11,53.44 45.11,54.46 44.3,55.27 44.3,56.08 45.11,56.9 45.11,57.1 45.52,57.51 JP1.5
  Bottom 0.203: v45.72,51.21 v56.08,51.21
TX0  (via drill 0.4, 0.5)
  Top 0.203: 60.35,59.33 IC1.1 | v29.26,33.33 29.26,34.54 R8.1 | v23.77,37.19 23.77,50.6 24.59,51.41 26.42,51.41 v26.42,51.61
  Top 0.254: IC1.8 64.77,51.87 v64.62,52.02 | v62.59,59.33 60.35,59.33 60.15,59.33 | IC4.8 26.57,51.46 v26.42,51.61 | v23.98,58.93 22.28,58.93 IC4.1
  Bottom 0.203: v29.26,33.33 25.4,37.19 v23.77,37.19 | v62.59,59.33 62.18,59.33 60.76,60.76 60.76,60.96 60.35,61.37 59.54,61.37 59.13,60.96 57.91,60.96 56.9,59.94 24.59,59.94 23.98,59.33 v23.98,58.93
  Bottom 0.254: v64.62,52.02 62.18,52.02 60.96,53.24 60.96,56.9 62.59,58.52 v62.59,59.33 | v26.42,51.61 24.38,51.61 22.76,53.24 22.76,56.08 23.98,57.3 v23.98,58.93
TX1  (via drill 0.4, 0.5)
  Top 0.203: 22.15,29.26 IC3.1 | v50.19,22.35 51.61,23.77 51.61,27.64 52.43,28.45 52.43,29.67 R12.1 | 60.15,29.67 IC5.1
  Top 0.254: IC5.8 64.36,22.2 v64.21,22.35 | v62.59,29.67 60.48,29.67 IC5.1 60.17,29.67 | IC3.8 26.57,21.79 v26.42,21.95 | v24.38,29.26 22.15,29.26 21.95,29.26 | R12.1 53.24,29.67 53.65,29.26 55.68,29.26 56.08,29.67 60.15,29.67
  Bottom 0.203: v26.42,21.95 27.23,21.95 27.64,22.35 v50.19,22.35
  Bottom 0.254: v64.21,22.35 61.77,22.35 60.55,23.57 60.55,26.01 62.59,28.04 v62.59,29.67 | v26.42,21.95 23.57,21.95 22.35,23.16 22.35,24.38 24.38,26.42 v24.38,29.26
VCC
  Top 0.203: 43.69,45.11 43.69,45.31 43.28,45.72 IC2.38 43.08,45.52 41.45,47.14 41.45,48.77 40.23,48.77 C1.1 | 43.69,45.11 43.69,39.01 42.27,37.59 IC2.5 | C6.1 52.22,35.56 52.22,35.76 51,36.98 IC2.17 50.8,36.98 50.6,36.98 50.19,37.39 50.19,43.48 51.21,44.5 IC2.27 51.41,44.7 52.83,46.13 52.83,46.33 | 52.83,46.33 C2.1 53.85,46.33 53.85,45.11 55.07,45.11 56.49,43.69 56.49,43.08 L1.2 | 52.83,46.33 51,46.33 50.39,45.72 IC2.29 50.19,45.52 48.97,44.3 44.7,44.3 43.89,45.11 43.69,45.11

### Text on the board
tNames: module_SensorControl | https://github.com/sosoru/TrainUtilizingSystem
bNames: D53371